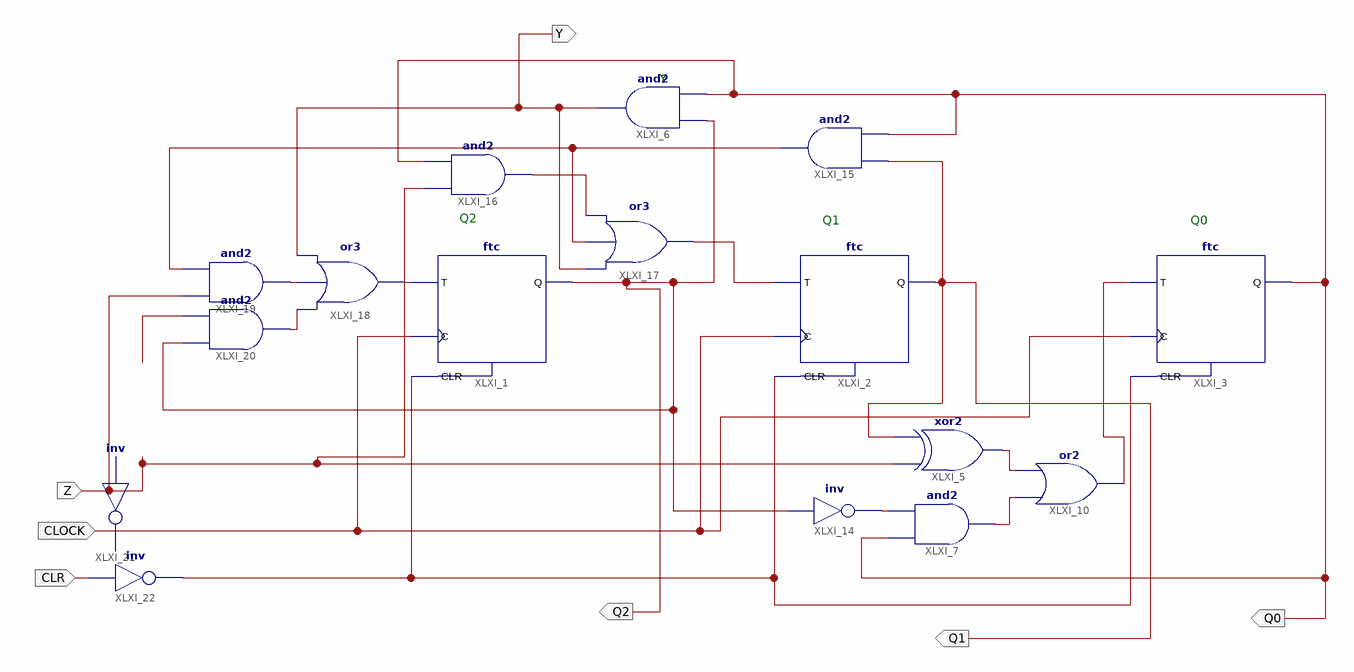
[diagram p0: schematic sheet 1]
// Xilinx ISE schematic MealyDetectorScheme.sch (xc9500xl) as structural Verilog: 16 symbols, 7 ports
module MealyDetectorScheme (
  input  Z,
  input  CLOCK,
  input  CLR,
  output Y,
  output Q0,
  output Q2,
  output Q1
);

  wire XLXN_1, XLXN_2, XLXN_3, XLXN_5, XLXN_9, XLXN_10, XLXN_14, XLXN_15, XLXN_16, XLXN_18, XLXN_20, XLXN_58;

  ftc XLXI_2 (.C(CLOCK), .CLR(XLXN_58), .T(XLXN_9), .Q(Q1));
  ftc XLXI_3 (.C(CLOCK), .CLR(XLXN_58), .T(XLXN_3), .Q(Q0));
  and XLXI_6 (Y, Q2, Q0);
  xor XLXI_5 (XLXN_1, Z, Q1);
  or XLXI_10 (XLXN_3, XLXN_2, XLXN_1);
  and XLXI_7 (XLXN_2, Q0, XLXN_5);
  not XLXI_14 (XLXN_5, Q2);
  and XLXI_15 (XLXN_18, Q0, Q1);
  or XLXI_17 (XLXN_9, Y, XLXN_18, XLXN_10);
  and XLXI_16 (XLXN_10, Z, Q0);
  ftc XLXI_1 (.C(CLOCK), .CLR(XLXN_58), .T(XLXN_14), .Q(Q2));
  or XLXI_18 (XLXN_14, XLXN_16, XLXN_15, Y);
  and XLXI_19 (XLXN_15, Z, XLXN_18);
  and XLXI_20 (XLXN_16, Q2, XLXN_20);
  not XLXI_21 (XLXN_20, Z);
  not XLXI_22 (XLXN_58, CLR);

  // Notes on the sheet:
  //   Y
  //   Q2
  //   Q1
  //   Q0
endmodule
